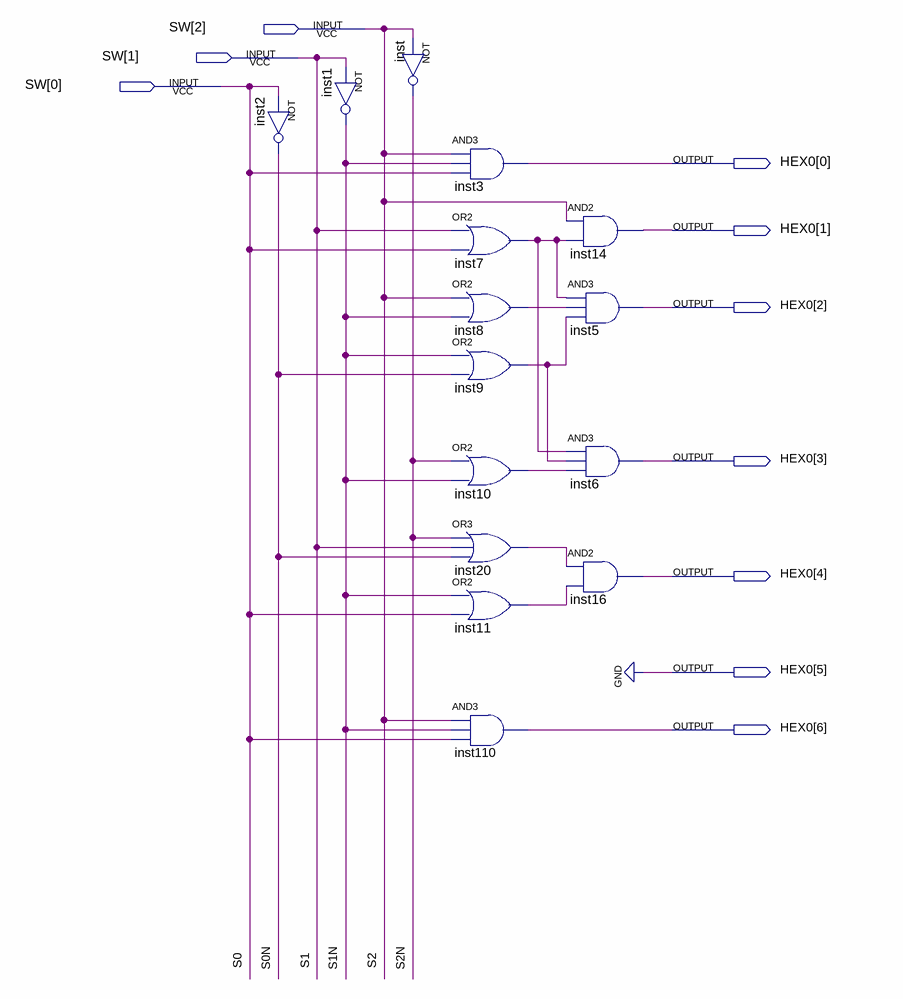
[diagram p0: schematic sheet]
// Quartus schematic pos.bdf as structural Verilog: 15 symbols, 10 pins
module pos (
  input  [2:0] SW,
  output [6:0] HEX0
);

  wire inst7_out, inst8_out, inst9_out, inst10_out, inst11_out, inst20_out, S0N, S1N, S2N;

  not inst1 (S1N, SW[1]);
  not inst2 (S0N, SW[0]);
  not inst (S2N, SW[2]);
  and inst3 (HEX0[0], SW[2], S1N, SW[0]);
  or inst7 (inst7_out, SW[1], SW[0]);
  or inst8 (inst8_out, SW[2], S1N);
  or inst9 (inst9_out, S1N, S0N);
  or inst10 (inst10_out, S2N, S1N);
  or inst20 (inst20_out, S2N, SW[1], S0N);
  or inst11 (inst11_out, S1N, SW[0]);
  and inst110 (HEX0[6], SW[2], S1N, SW[0]);
  and inst14 (HEX0[1], SW[2], inst7_out);
  and inst5 (HEX0[2], inst7_out, inst8_out, inst9_out);
  and inst6 (HEX0[3], inst7_out, inst9_out, inst10_out);
  and inst16 (HEX0[4], inst20_out, inst11_out);

  assign HEX0[5] = 1'b0;

  // Other names for the same wires on the sheet: S0 = SW[0]; S1 = SW[1]; S2 = SW[2]
endmodule
